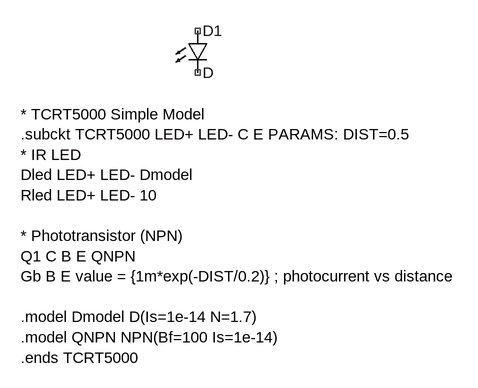
[diagram p0: schematic Sensor_Panel.asc]
Sensor_Panel.asc, the LTspice schematic file:
Version 4
SHEET 1 880 680
SYMBOL LED 80 64 R0
SYMATTR InstName D1
TEXT -176 192 Left 0 !* TCRT5000 Simple Model\n.subckt TCRT5000 LED+ LED- C E PARAMS: DIST=0.5\n* IR LED\nDled LED+ LED- Dmodel\nRled LED+ LED- 10\n \n* Phototransistor (NPN)\nQ1 C B E QNPN\nGb B E value = {1m*exp(-DIST/0.2)} ; photocurrent vs distance\n \n.model Dmodel D(Is=1e-14 N=1.7)\n.model QNPN NPN(Bf=100 Is=1e-14)\n.ends TCRT5000

The netlist it stands for:
* Sensor_Panel.asc
D1 NC_01 NC_02 D
.model D D
.lib standard.dio
* TCRT5000 Simple Model
.subckt TCRT5000 LED+ LED- C E PARAMS: DIST=0.5
* IR LED
Dled LED+ LED- Dmodel
Rled LED+ LED- 10
* Phototransistor (NPN)
Q1 C B E QNPN
Gb B E value = {1m*exp(-DIST/0.2)} ; photocurrent vs distance
.model Dmodel D(Is=1e-14 N=1.7)
.model QNPN NPN(Bf=100 Is=1e-14)
.ends TCRT5000
.backanno
.end